# Altium schematic sheet TopSheet.SchDoc
size A4; SheetNumber: 1; SheetTotal: 4
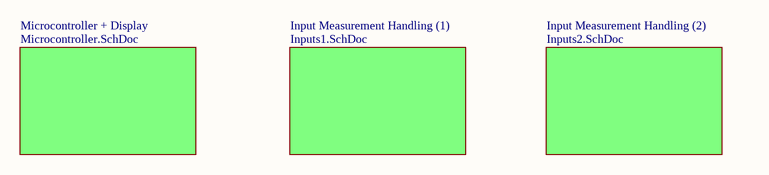
[diagram p0: TopSheet.SchDoc]

## Sub-sheets
Input Measurement Handling (1) = Inputs1.SchDoc: no entries
Input Measurement Handling (2) = Inputs2.SchDoc: no entries
Microcontroller + Display = Microcontroller.SchDoc: no entries